# EAGLE design W050C (EAGLE 6.6.0)
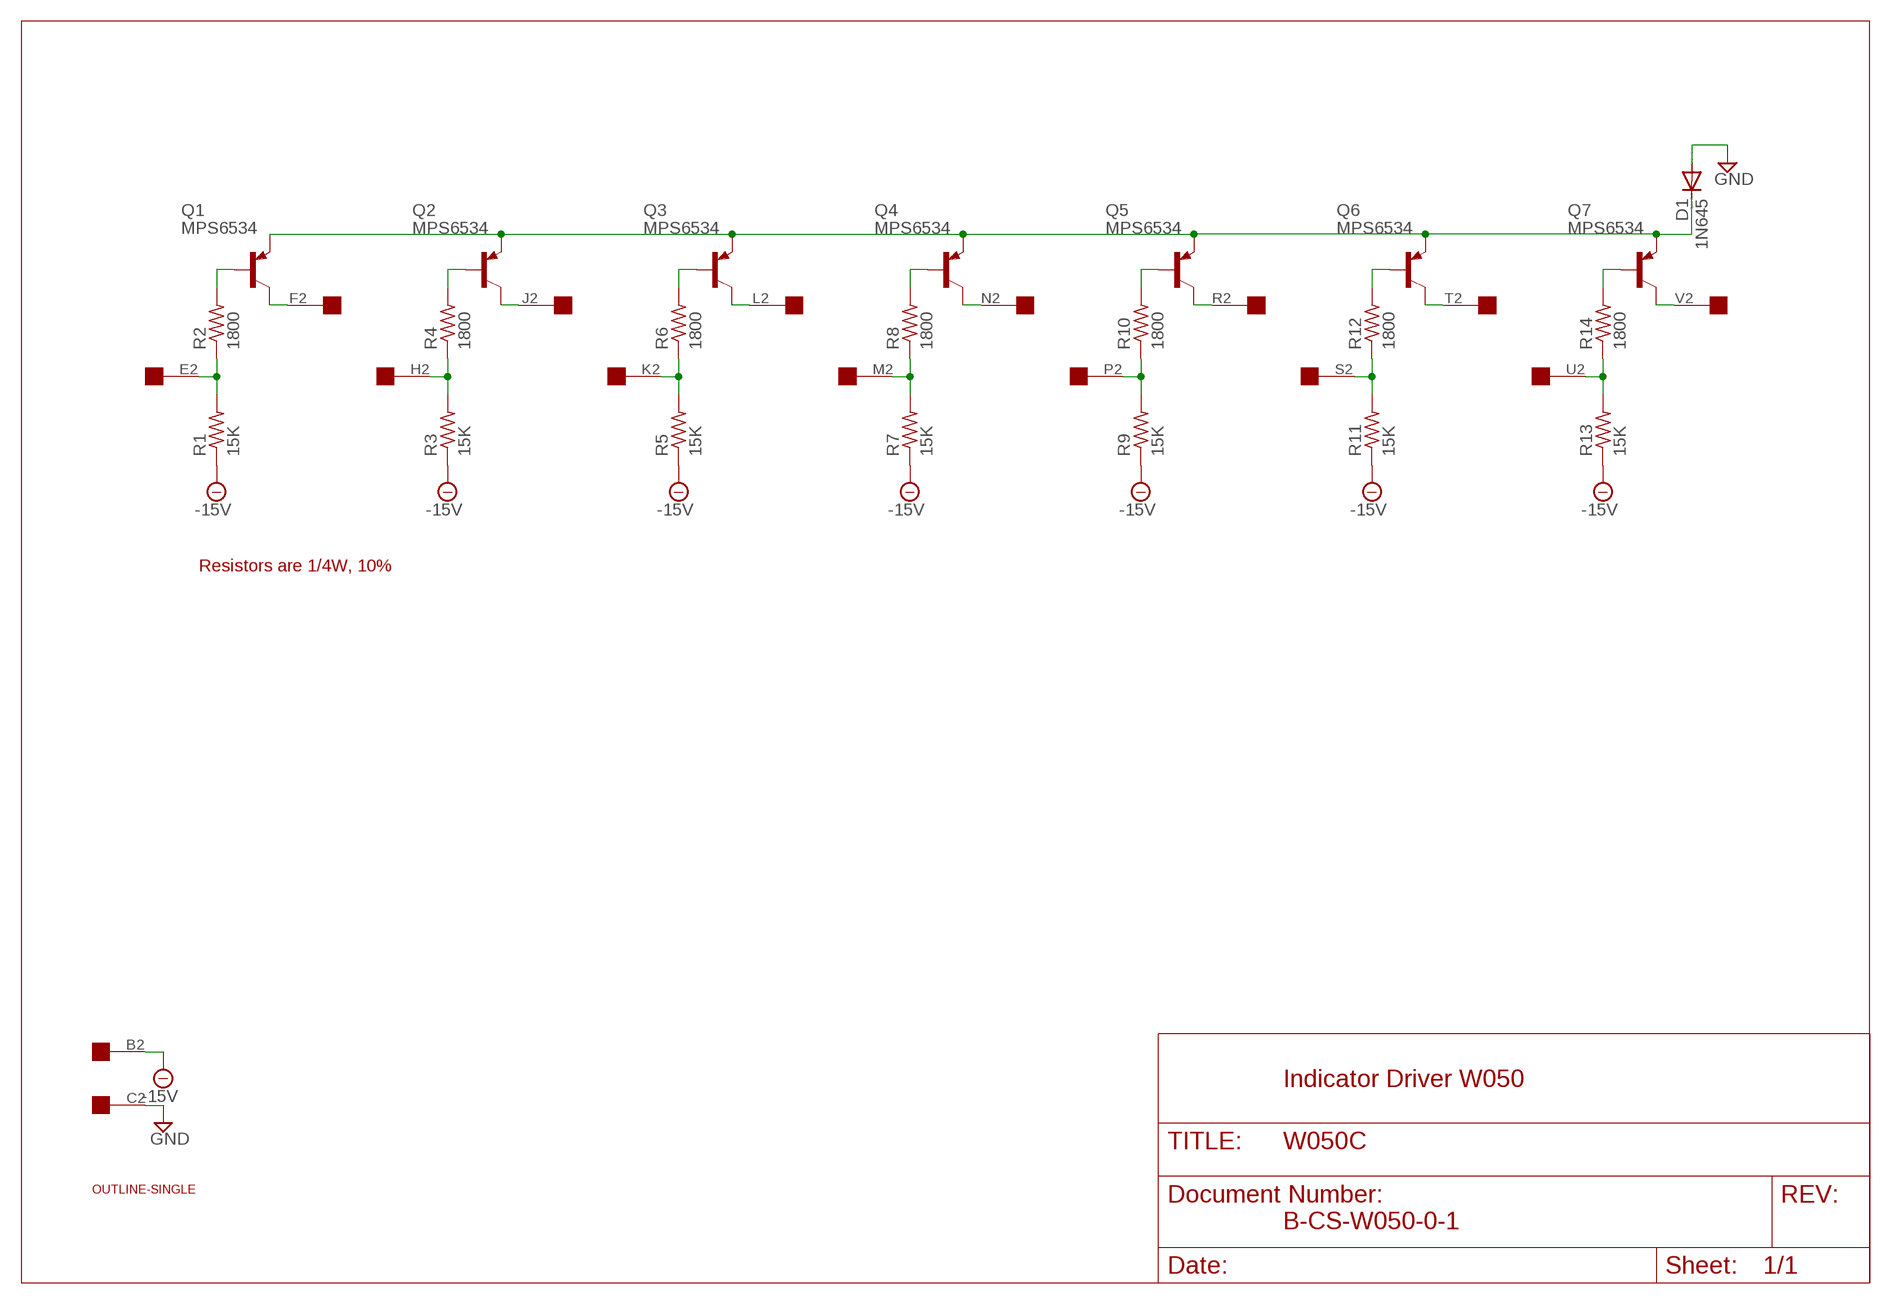
[diagram p0: schematic, sheet 1]

## Parts
D1  1N645  1N4148DO35-10  [DO35-10]
EDGE  EDGE-1  [EDGE-CON1]
Q1  MPS6534  2N2904  [TO39]
Q2  MPS6534  2N2904  [TO39]
Q3  MPS6534  2N2904  [TO39]
Q4  MPS6534  2N2904  [TO39]
Q5  MPS6534  2N2904  [TO39]
Q6  MPS6534  2N2904  [TO39]
Q7  MPS6534  2N2904  [TO39]
R1  15K  R-US_0207/10  [0207/10]
R2  1800  R-US_0207/10  [0207/10]
R3  15K  R-US_0207/10  [0207/10]
R4  1800  R-US_0207/10  [0207/10]
R5  15K  R-US_0207/10  [0207/10]
R6  1800  R-US_0207/10  [0207/10]
R7  15K  R-US_0207/10  [0207/10]
R8  1800  R-US_0207/10  [0207/10]
R9  15K  R-US_0207/10  [0207/10]
R10  1800  R-US_0207/10  [0207/10]
R11  15K  R-US_0207/10  [0207/10]
R12  1800  R-US_0207/10  [0207/10]
R13  15K  R-US_0207/10  [0207/10]
R14  1800  R-US_0207/10  [0207/10]
U$1  OUTLINE-SINGLE  [SINGLE]

## Nets
-15V [Supply]: EDGE.B2 R1.1 R3.1 R5.1 R7.1 R9.1 R11.1 R13.1
GND [Supply]: D1.A EDGE.C2
N$1: EDGE.E2 R1.2 R2.1
N$2 [Supply]: EDGE.F2 Q1.3(C)
N$3: Q1.2(B) R2.2
N$4: EDGE.H2 R3.2 R4.1
N$5 [Supply]: EDGE.J2 Q2.3(C)
N$6: Q2.2(B) R4.2
N$7: EDGE.M2 R7.2 R8.1
N$8 [Supply]: EDGE.N2 Q4.3(C)
N$9: Q4.2(B) R8.2
N$10: EDGE.K2 R5.2 R6.1
N$11 [Supply]: EDGE.L2 Q3.3(C)
N$12: Q3.2(B) R6.2
N$13: EDGE.P2 R9.2 R10.1
N$14 [Supply]: EDGE.R2 Q5.3(C)
N$15: Q5.2(B) R10.2
N$16: EDGE.S2 R11.2 R12.1
N$17 [Supply]: EDGE.T2 Q6.3(C)
N$18: Q6.2(B) R12.2
N$19: EDGE.U2 R13.2 R14.1
N$20 [Supply]: EDGE.V2 Q7.3(C)
N$21: Q7.2(B) R14.2
N$22 [Supply]: D1.C Q1.1(E) Q2.1(E) Q3.1(E) Q4.1(E) Q5.1(E) Q6.1(E) Q7.1(E)
Unconnected: EDGE.A2 EDGE.D2

## Notes on the sheet
- Resistors are 1/4W, 10%
- Indicator Driver W050
- B-CS-W050-0-1

## Library data of the parts
D1 = diode:1N4148: DIODE high speed (Philips)
EDGE = dec-con:EDGE-1: Single-Sided DEC Edge Connector -- (side 2)
Q1-Q7 = transistor-pnp:2N2904*: PNP Transistror
R1-R14 = rcl:R-US_: RESISTOR, American symbol
U$1 = dec-con:OUTLINE-*: Board outlines for DEC boards.

## Net classes
1 Supply: width 0.813 mm

## Board
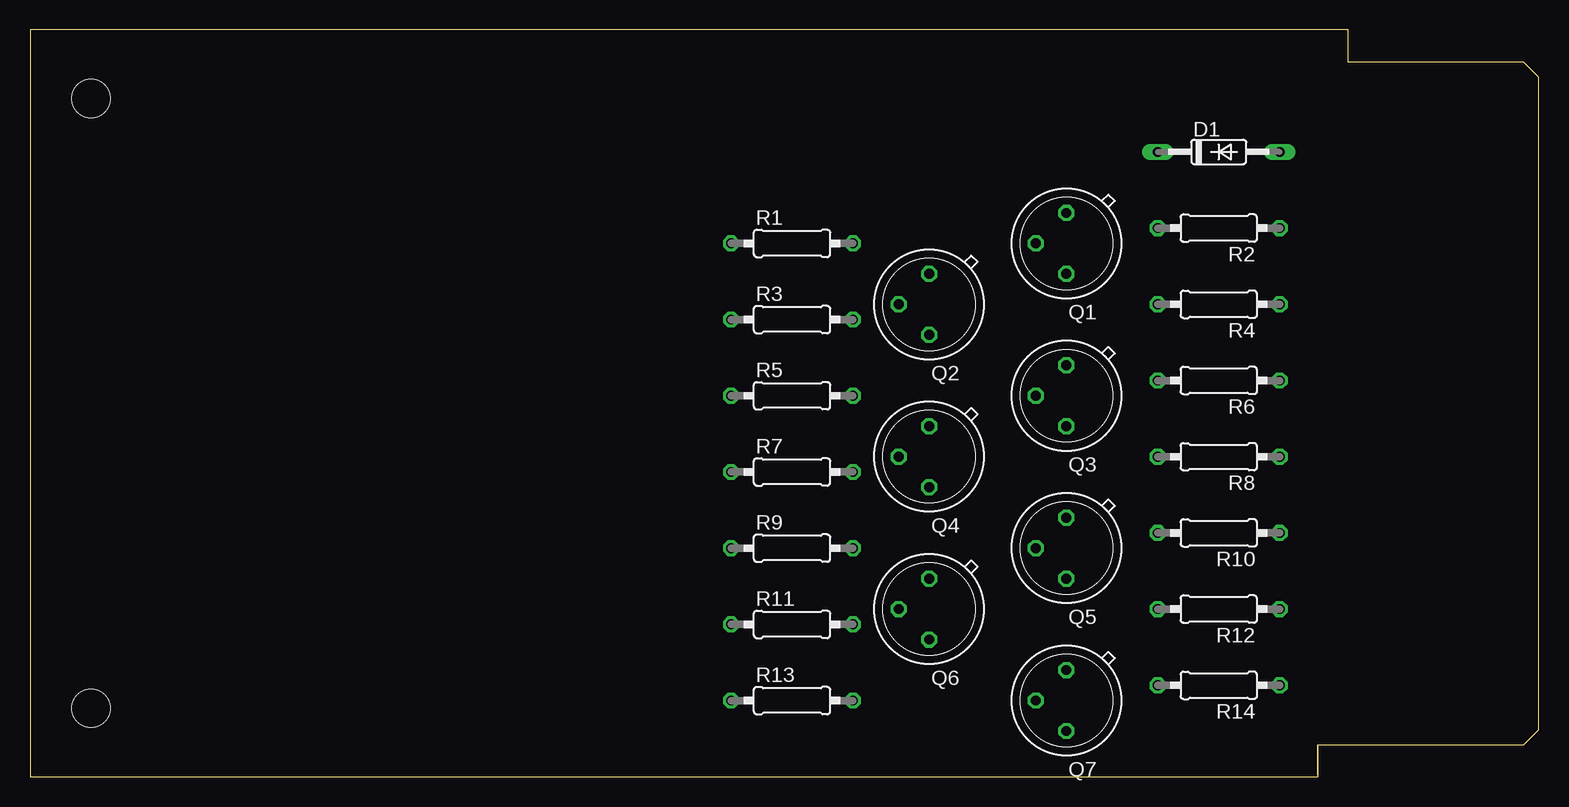
[diagram p1: board, top side]
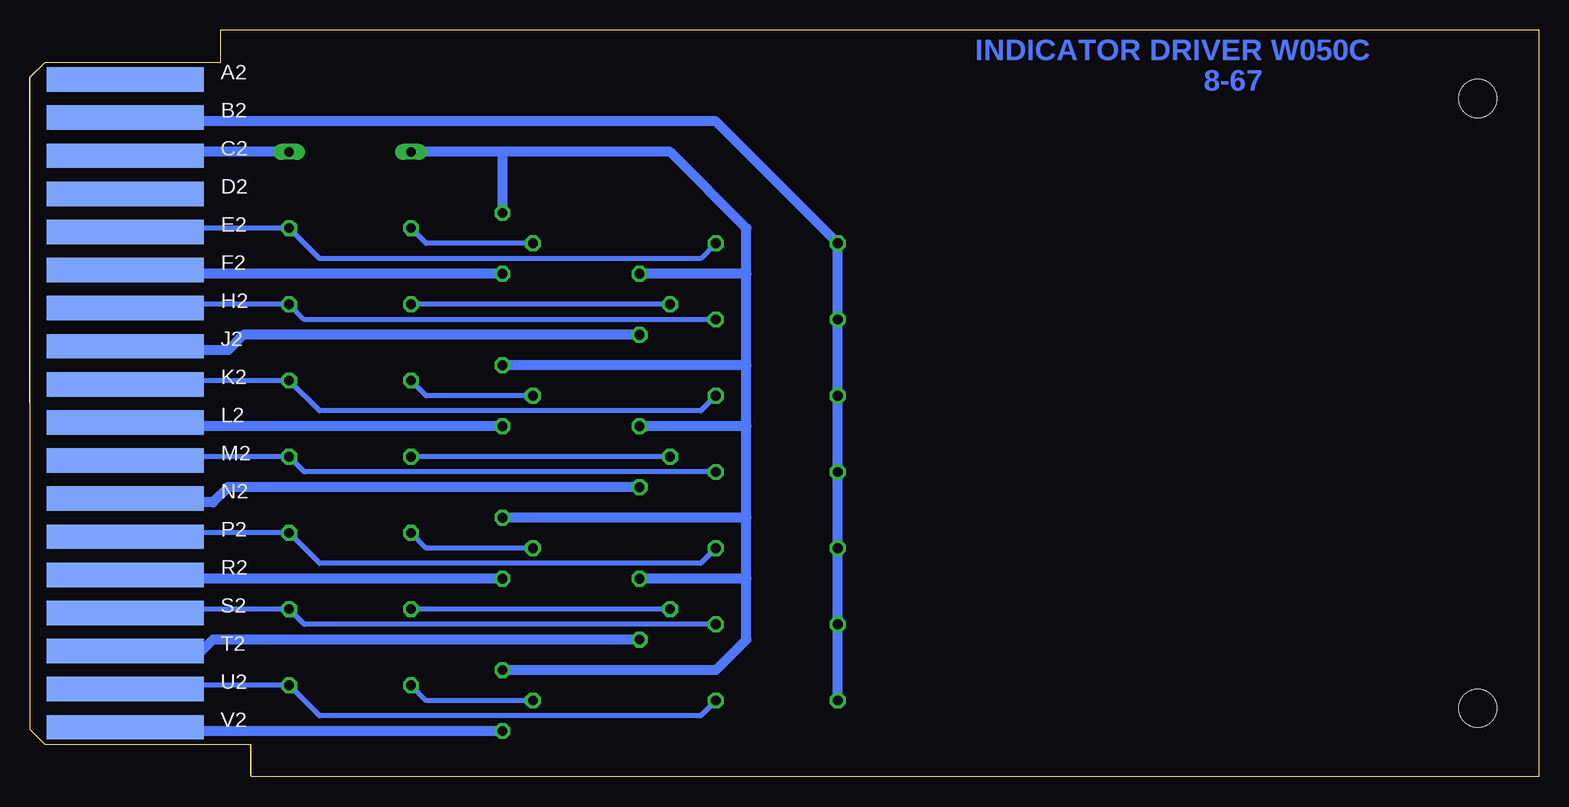
[diagram p2: board, bottom side, seen from below]

Size 125.73 x 62.23 mm. Coordinates in mm from the lower left corner, seen from the top.
Copper layers (1+16): Top 0.035mm / dielectric 1.5mm / Bottom 0.035mm
Design rules "16mils": minimum track width 16mil, minimum drill 32mil, track to track 15mil, track to pad 10mil, pad to pad 10mil, via to via 10mil, smd to smd 10mil, copper to edge 13mil, drill to drill 10mil, minimum pad ring 10mil, minimum via ring 8mil, stop-mask expansion 0mil, vias tented up to drill 0mil, thermal gap 10mil

### Footprints (pad centres in the part's own frame; a part is rotated, then mirrored left to right if it is on the bottom)
DO35-10 = drill 0.813 long: A 5.08,0; C -5.08,0
EDGE-CON1 = smd 13.106 x 2.032 bottom: A2 7.938,4.128; B2 7.938,7.303; C2 7.938,10.477; D2 7.938,13.652; E2 7.938,16.828; F2 7.938,20.003; H2 7.938,23.177; J2 7.938,26.352; K2 7.938,29.527; L2 7.938,32.703; M2 7.938,35.877; N2 7.938,39.053; P2 7.938,42.227; R2 7.938,45.403; S2 7.938,48.578; T2 7.938,51.752; U2 7.938,54.928; V2 7.938,58.102
TO39 = drill 0.813 octagon: 1 0,-2.54; 2 2.54,0; 3 0,2.54
0207/10 = drill 0.813 octagon: 1 -5.08,0; 2 5.08,0
SINGLE = hole 3.175: 120.65,56.515; 120.65,5.715

### Placement (x,y rotation side)
D1  99.06,52.07 0 top
EDGE  125.73,62.23 180 top
Q1  86.36,44.45 180 top
Q2  74.93,39.37 180 top
Q3  86.36,31.75 180 top
Q4  74.93,26.67 180 top
Q5  86.36,19.05 180 top
Q6  74.93,13.97 180 top
Q7  86.36,6.35 180 top
R1  63.5,44.45 0 top
R2  99.06,45.72 180 top
R3  63.5,38.1 0 top
R4  99.06,39.37 180 top
R5  63.5,31.75 0 top
R6  99.06,33.02 180 top
R7  63.5,25.4 0 top
R8  99.06,26.67 180 top
R9  63.5,19.05 0 top
R10  99.06,20.32 180 top
R11  63.5,12.7 0 top
R12  99.06,13.97 180 top
R13  63.5,6.35 0 top
R14  99.06,7.62 180 top
U$1  125.73,62.23 180 top

### Tracks (layer width: path | path; a pad name or v marks a point on that pad's centre or on a via)
-15V
  Bottom 0.813: EDGE.B2 117.13,54.9 116.84,54.61 68.58,54.61 R1.1 R3.1 R5.1 R7.1 R9.1 R11.1 R13.1
GND
  Bottom 0.813: EDGE.C2 117.17,51.74 116.84,52.07 D1.A
N$1
  Bottom 0.406: EDGE.E2 117.17,45.39 116.84,45.72 R2.1 101.6,43.18 69.85,43.18 R1.2
N$2
  Bottom 0.813: EDGE.F2 117.12,42.19 116.84,41.91 Q1.3
N$3
  Bottom 0.406: R2.2 92.71,44.45 Q1.2
N$4
  Bottom 0.406: EDGE.H2 117.17,39.04 116.84,39.37 R4.1 102.87,38.1 R3.2
N$5
  Bottom 0.813: EDGE.J2 117.17,35.89 116.84,35.56 109.22,35.56 107.95,36.83 Q2.3
N$6
  Bottom 0.406: Q2.2 R4.2
N$7
  Bottom 0.406: EDGE.M2 117.17,26.34 116.84,26.67 R8.1 102.87,25.4 R7.2
N$8
  Bottom 0.813: EDGE.N2 117.17,23.19 116.84,22.86 110.49,22.86 109.22,24.13 Q4.3
N$9
  Bottom 0.406: Q4.2 R8.2
N$10
  Bottom 0.406: EDGE.K2 117.14,32.72 116.84,33.02 R6.1 101.6,30.48 69.85,30.48 R5.2
N$11
  Bottom 0.813: EDGE.L2 117.17,29.54 116.84,29.21 Q3.3
N$12
  Bottom 0.406: R6.2 92.71,31.75 Q3.2
N$13
  Bottom 0.406: EDGE.P2 117.17,19.99 116.84,20.32 R10.1 101.6,17.78 69.85,17.78 R9.2
N$14
  Bottom 0.813: EDGE.R2 117.17,16.84 116.84,16.51 Q5.3
N$15
  Bottom 0.406: Q5.2 92.71,19.05 R10.2
N$16
  Bottom 0.406: EDGE.S2 117.14,13.66 116.84,13.97 R12.1 102.87,12.7 R11.2
N$17
  Bottom 0.813: EDGE.T2 117.17,10.49 116.84,10.16 111.76,10.16 110.49,11.43 Q6.3
N$18
  Bottom 0.406: Q6.2 R12.2
N$19
  Bottom 0.406: EDGE.U2 117.2,7.26 116.84,7.62 R14.1 101.6,5.08 69.85,5.08 R13.2
N$20
  Bottom 0.813: EDGE.V2 117.16,4.13 116.84,3.81 Q7.3
N$21
  Bottom 0.406: Q7.2 92.71,6.35 R14.2
N$22
  Bottom 0.813: 86.36,52.07 72.39,52.07 66.04,45.72 66.04,41.91 | 86.36,52.07 D1.C | 66.04,41.91 Q2.1 | 66.04,29.21 Q4.1 | 66.04,29.21 66.04,34.29 | 66.04,34.29 66.04,41.91 | 66.04,16.51 Q6.1 | 66.04,16.51 66.04,21.59 | 66.04,21.59 66.04,29.21 | Q7.1 68.58,8.89 66.04,11.43 66.04,16.51 | 66.04,21.59 Q5.1 | 66.04,34.29 Q3.1 | 86.36,52.07 Q1.1

### Text on the board
Bottom: INDICATOR DRIVER W050C | 8-67